# Altium schematic sheet RF_Ticketing_Slave.SchDoc
size A4; Author: Mario Dos Santos; Organization: ETML-ES; Address1: Avenue Recordon 1; Address2: 1004 Lausanne; Address3: Switzerland; SheetNumber: 5; SheetTotal: 5
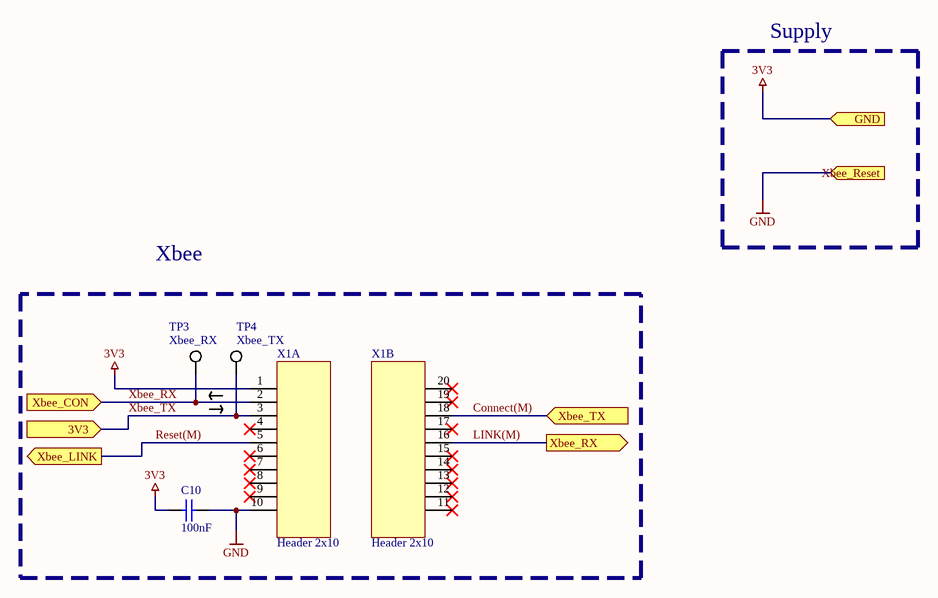
[diagram p0: RF_Ticketing_Slave.SchDoc]

## Parts
C10  100nF  [6-0805_N]
TP3  value Xbee_RX  [KSTN-5019_V]
TP4  value Xbee_TX  [KSTN-5019_V]
X1  Header 2x10  [ZB-SB]  (parts A,B of 2)

## Ports
3V3 (in), GND (in), Xbee_CON (in), Xbee_LINK (out), Xbee_Reset (in), Xbee_RX (out), Xbee_TX (in)

## Nets
3V3: C10.2 X1.1 ; port GND
GND: C10.1 X1.10 ; port Xbee_Reset
Connect(M): X1.18 ; port Xbee_TX
LINK(M): X1.16 ; port Xbee_RX
Reset(M): X1.5 ; port Xbee_LINK
Xbee_RX: TP3.1 X1.2 ; port Xbee_CON
Xbee_TX: TP4.1 X1.3 ; port 3V3

Not connected (* = marked no-connect by the designer): X1 4* 6* 7* 8* 9* 11* 12* 13* 14* 15* 17* 19* 20*

## Notes on the sheet
- Supply
- Xbee
- Fichier :
- a
- Date :
- Heure :
- Version :
- Auteur :
- Modif.
- b
- c
- d
- Projet :
- No :
- Nb feuilles
- Feuille n°
- Chemin :

## Library data of the parts
C10 = Cap_1: Capacitor; Value: 100nF; Supplier: Digi-Key; Supplier Part Number: 399-C0805C104M5RAC7800CT-ND; Supplier unit price: 0.1
TP3 TP4 = CMP-1672-00008-1: Test Point, 1 Position SMD, RoHS, Tape and Reel; Supplier: Digi-Key; Supplier Part Number: 36-5019CT-ND; Supplier unit price: 0.33
X1 = HDR ZB-SB 2x10_1: Header 2x10 / Xbee de letml(1623) ou xbee XB24CAUIT-001; Value: Header 2x10; Supplier: Digi-Key